# EAGLE schematic Autopilot-8 (EAGLE 7.3.0)
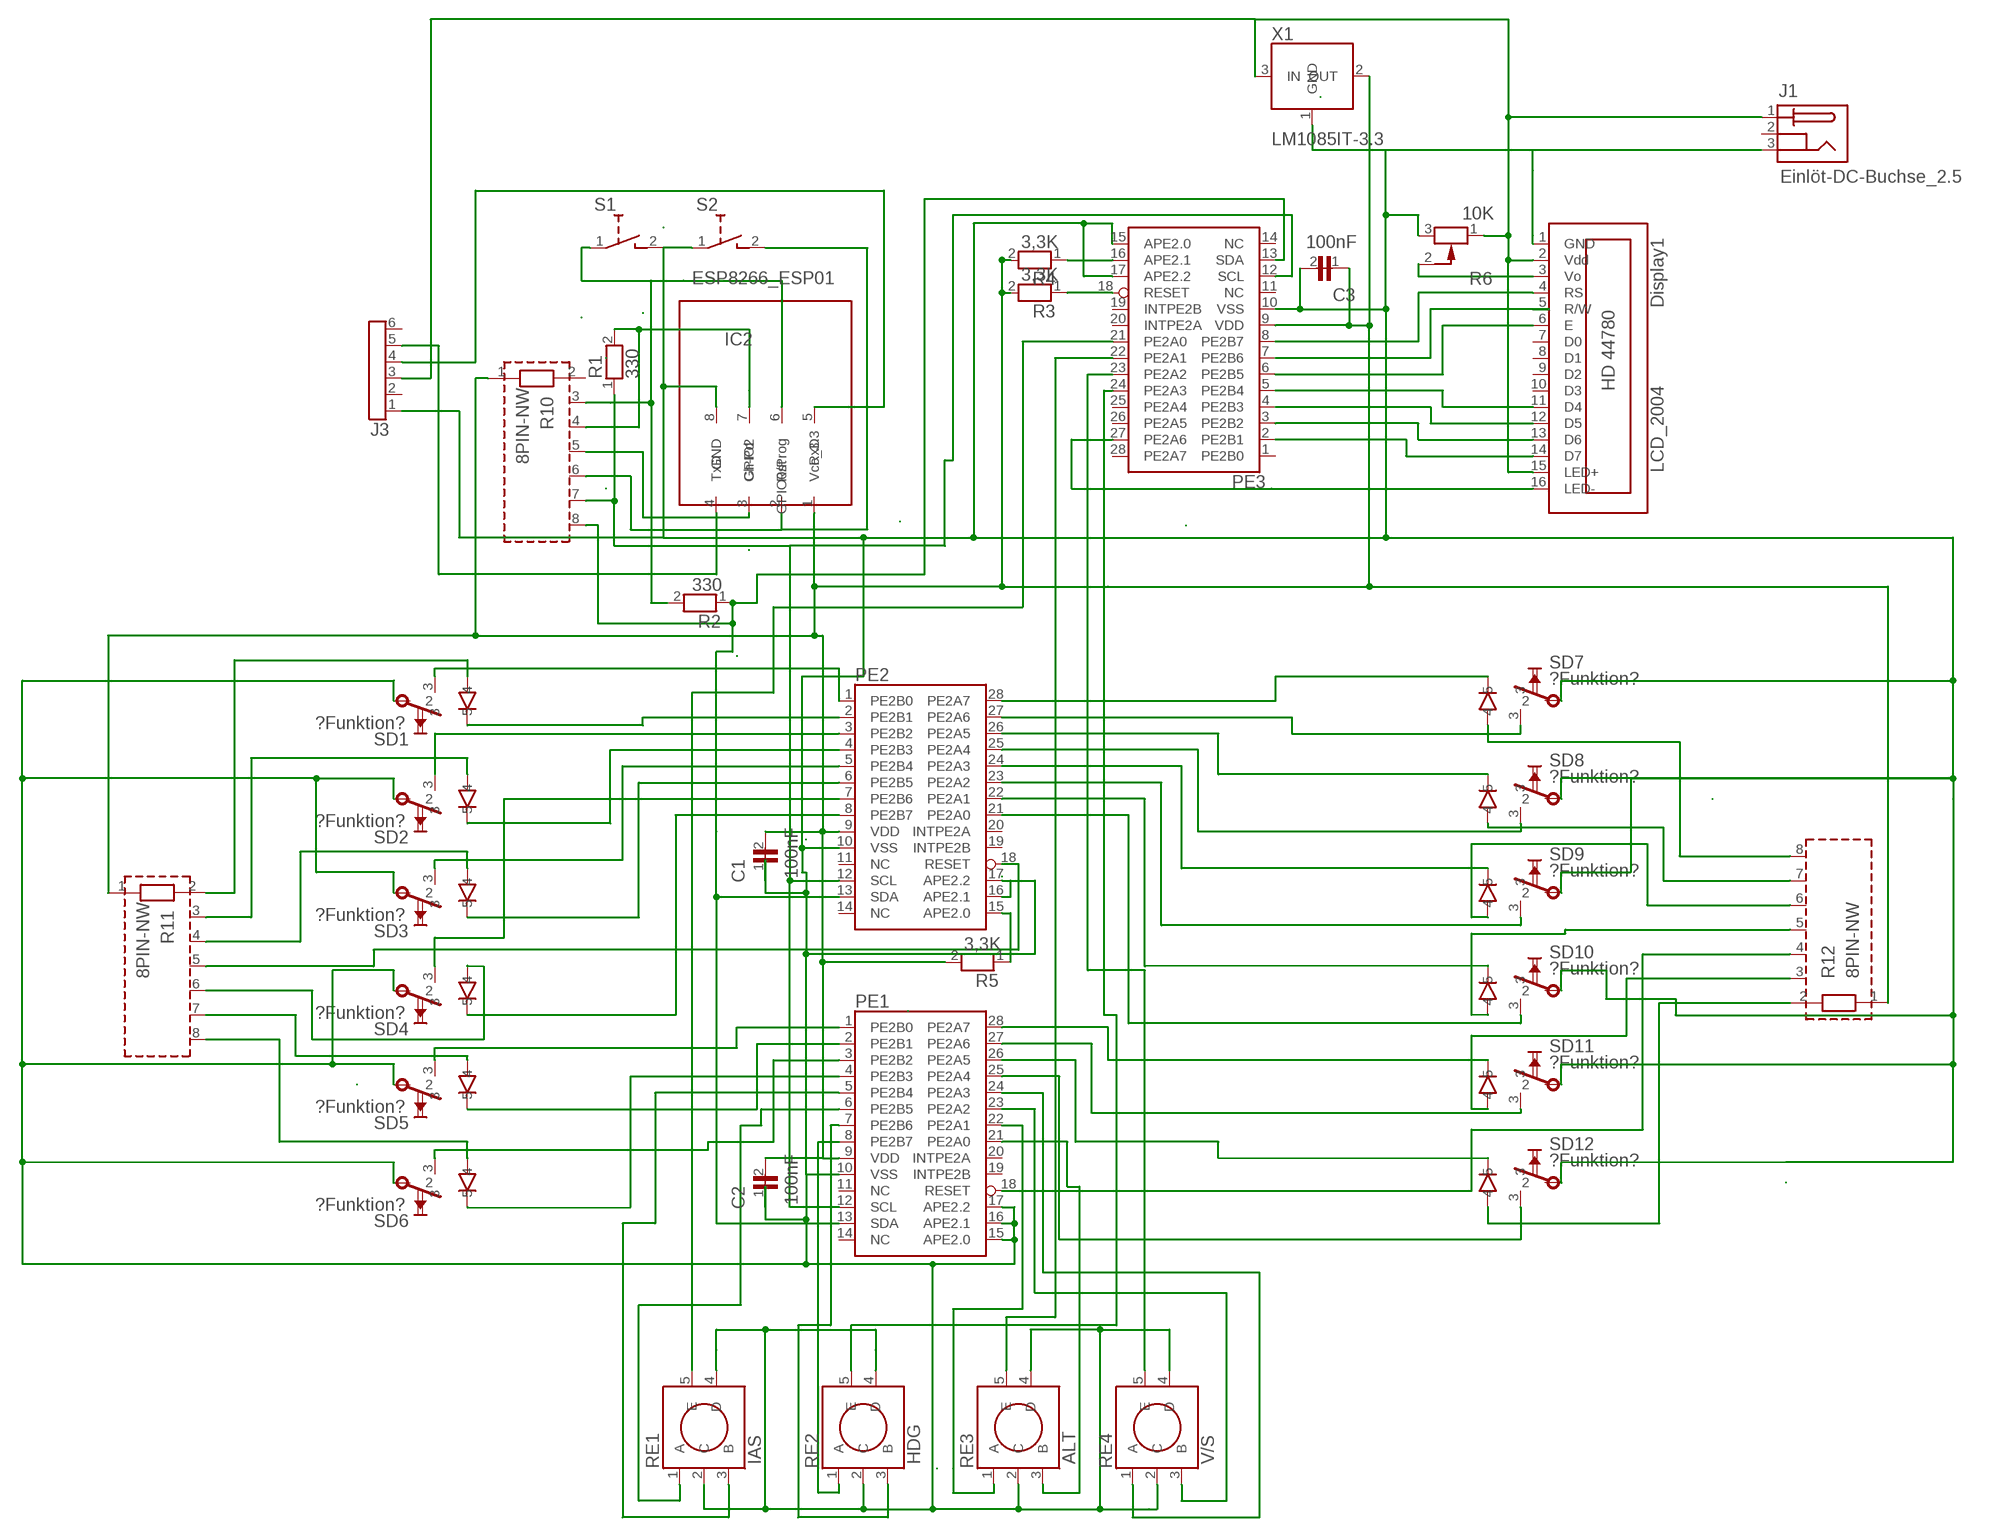
[diagram p0: schematic, sheet 1]

## Parts
C1  100nF  B32521-C1104-K_11  [4X13R10,16_11]
C2  100nF  B32521-C1104-K_12  [4X13R10,16_12]
C3  100nF  B32521-C1104-K_15  [4X13R10,16_15]
Display1  LCD_2004  LCD_2004_13  [LCD2004_13]
IC2  ESP8266_ESP01  ESP8266_ESP01_6  [ESP01_6]
J1  Einlöt-DC-Buchse_2.5  Einlöt-DC-Buchse_2.5_36  [EINLÖT-DC-BUCHSE_2.5MM_36]
J3  PinHeader_1x06_W_2,54  PinHeader_1x06_W_2,54_32  [1X06-90_32]
PE1  PORTEXPANDER MCP23017  PORTEXPANDER_MCP23017_4  [PortExpander_Gehäuse:PDIP-28_4]
PE2  PORTEXPANDER MCP23017  PORTEXPANDER_MCP23017_5  [PortExpander_Gehäuse:PDIP-28_5]
PE3  PORTEXPANDER MCP23017  PORTEXPANDER_MCP23017_14  [PortExpander_Gehäuse:PDIP-28_14]
R1  330  R_carbon_330-Ohm_0207_7  [0207_7]
R2  330  R_carbon_3,3K_0207_8  [0207_8]
R3  3,3K  R_carbon_3,3K_0207_17  [0207_17]
R4  3,3K  R_carbon_3,3K_0207_18  [0207_18]
R5  3,3K  R_carbon_3,3K_0207_19  [0207_19]
R6  10K  PD84_10K_35  [POTI_PD84_35]
R10  8PIN-NW  8PIN-NW_16  [SIL8_16]
R11  8PIN-NW  8PIN-NW_9  [SIL8_9]
R12  8PIN-NW  8PIN-NW_10  [SIL8_10]
RE1  IAS  STEC12E08_3  [STEC12E08_3]
RE2  HDG  STEC12E08_2  [STEC12E08_2]
RE3  ALT  STEC12E08_1  [STEC12E08_1]
RE4  V/S  STEC12E08_0  [STEC12E08_0]
S1  PHAP3362A  PHAP3362A_33  [KURZHUBTASTER_DURCHSTECKMONT._33]
S2  PHAP3362A  PHAP3362A_34  [KURZHUBTASTER_DURCHSTECKMONT._34]
SD1  TASTER_DIGITAST_STD-LED-SJS  TASTER_DIGITAST_STD-LED-SJS_20  [TASTER_DIGITAST_STD(#1)(#1)_20]
SD2  TASTER_DIGITAST_STD-LED-SJS  TASTER_DIGITAST_STD-LED-SJS_21  [TASTER_DIGITAST_STD(#1)(#1)_21]
SD3  TASTER_DIGITAST_STD-LED-SJS  TASTER_DIGITAST_STD-LED-SJS_22  [TASTER_DIGITAST_STD(#1)(#1)_22]
SD4  TASTER_DIGITAST_STD-LED-SJS  TASTER_DIGITAST_STD-LED-SJS_23  [TASTER_DIGITAST_STD(#1)(#1)_23]
SD5  TASTER_DIGITAST_STD-LED-SJS  TASTER_DIGITAST_STD-LED-SJS_24  [TASTER_DIGITAST_STD(#1)(#1)_24]
SD6  TASTER_DIGITAST_STD-LED-SJS  TASTER_DIGITAST_STD-LED-SJS_25  [TASTER_DIGITAST_STD(#1)(#1)_25]
SD7  TASTER_DIGITAST_STD-LED-SJS  TASTER_DIGITAST_STD-LED-SJS_26  [TASTER_DIGITAST_STD(#1)(#1)_26]
SD8  TASTER_DIGITAST_STD-LED-SJS  TASTER_DIGITAST_STD-LED-SJS_27  [TASTER_DIGITAST_STD(#1)(#1)_27]
SD9  TASTER_DIGITAST_STD-LED-SJS  TASTER_DIGITAST_STD-LED-SJS_28  [TASTER_DIGITAST_STD(#1)(#1)_28]
SD10  TASTER_DIGITAST_STD-LED-SJS  TASTER_DIGITAST_STD-LED-SJS_29  [TASTER_DIGITAST_STD(#1)(#1)_29]
SD11  TASTER_DIGITAST_STD-LED-SJS  TASTER_DIGITAST_STD-LED-SJS_30  [TASTER_DIGITAST_STD(#1)(#1)_30]
SD12  TASTER_DIGITAST_STD-LED-SJS  TASTER_DIGITAST_STD-LED-SJS_31  [TASTER_DIGITAST_STD(#1)(#1)_31]
X1  LM1085IT-3.3  LM1085IT-3.3_37  [TO220_37]

## Nets
5V: Display1.2(Vdd) Display1.15(LED+) J1.1(S) J3.3 R6.1 X1.3(IN)
ALT: PE2.23(PE2A2) SD9.3
AP-AUTO: PE2.5(PE2B4) SD3.3
AP-OFF: PE2.1(PE2B0) SD1.3
AP-ON: PE2.3(PE2B2) SD2.3
APE2.0: PE2.15(APE2.0) R5.1
ATHR: PE1.1(PE2B0) SD5.3
B: PE1.23(PE2A2) RE4.3(B)
BC: PE1.25(PE2A4) SD12.3
D4: Display1.11(D4) PE3.5(PE2B4)
D6: Display1.13(D6) PE3.3(PE2B2)
ESP-RST: IC2.2(Rst) R10.6 S2.2
FLCH: PE2.7(PE2B6) SD4.3
GND: C1.1 C2.1 C3.2 Display1.1(GND) IC2.8(GND) J1.3(T) J3.1 PE1.10(VSS) PE1.15(APE2.0) PE1.16(APE2.1) PE1.17(APE2.2) PE2.10(VSS) PE2.16(APE2.1) PE2.17(APE2.2) PE3.10(VSS) PE3.15(APE2.0) PE3.17(APE2.2) R6.3 RE1.2(C) RE1.4(D) RE2.2(C) RE2.4(D) RE3.2(C) RE3.4(D) RE4.2(C) RE4.4(D) S1.2 S2.1 SD1.2 SD2.2 SD3.2 SD4.2 SD5.2 SD6.2 SD7.2 SD8.2 SD9.2 SD10.2 SD11.2 SD12.2 X1.1(GND)
GPIO0/Prog: IC2.6(GPIO0/Prog) R2.2 R10.3 S1.1
GPIO2: IC2.7(GPIO2) R1.2 R10.4
GS: PE2.21(PE2A0) SD10.3
HDG: PE2.27(PE2A6) SD7.3
LED-ALT: PE2.24(PE2A3) SD9.4
LED-AP-AUTP: PE2.6(PE2B5) SD3.4
LED-AP-OFF: PE2.2(PE2B1) SD1.4
LED-AP-ON: PE2.4(PE2B3) SD2.4
LED-ATHR: PE1.2(PE2B1) SD5.4
LED-BC: PE1.26(PE2A5) SD12.4
LED-FLCH: PE2.8(PE2B7) SD4.4
LED-GS: PE2.22(PE2A1) SD10.4
LED-HDG: PE2.28(PE2A7) SD7.4
LED-LOC: PE1.4(PE2B3) SD6.4
LED-VNAV: PE2.26(PE2A5) SD8.4
LED-VS: PE1.28(PE2A7) SD11.4
LOC: PE1.3(PE2B2) SD6.3
PE2A1: PE1.22(PE2A1) RE3.1(A)
PE2B4: PE1.5(PE2B4) RE1.3(B)
PE2B5: Display1.12(D5) PE3.4(PE2B3)
PE2B6: PE1.7(PE2B6) RE2.3(B)
R/W: Display1.5(R/W) PE3.7(PE2B6)
RESET: PE1.18(RESET) R12.4
RS: Display1.4(RS) PE3.8(PE2B7)
SCL: PE1.12(SCL) PE2.12(SCL) PE3.12(SCL) R1.1 R10.7
SDA: PE1.13(SDA) PE2.13(SDA) PE3.13(SDA) R2.1 R10.8
Sig$24: PE1.21(PE2A0) RE3.3(B)
Sig$27: PE1.8(PE2B7) RE2.1(A)
Sig$29: PE1.6(PE2B5) RE1.1(A)
Sig$107: R12.2 SD12.5
Sig$108: R12.7 SD8.5
Sig$118: IC2.3(Ch-Pd) R10.5
Sig$129: R12.3 SD11.5
Sig$131: R12.6 SD9.5
Sig$132: R12.8 SD7.5
Sig$137: R11.2 SD1.5
Sig$138: R11.3 SD2.5
Sig$139: R11.4 SD3.5
Sig$140: PE2.18(RESET) R11.5
Sig$141: R11.6 SD4.5
Sig$142: R11.7 SD5.5
Sig$143: R11.8 SD6.5
Sig$195: Display1.14(D7) PE3.2(PE2B1)
Sig$208: Display1.6(E) PE3.6(PE2B5)
Sig$209: PE3.18(RESET) R3.1
Sig$211: PE3.16(APE2.1) R4.1
Sig$230: R12.5 SD10.5
Sig$260: Display1.16(LED-) PE3.27(PE2A6)
Sig$269: IC2.5(RxD) J3.4
ss0: PE3.21(PE2A0) RE1.5(E)
ss1: PE3.22(PE2A1) RE3.5(E)
ss2: PE3.23(PE2A2) RE4.5(E)
ss3: PE3.24(PE2A3) RE2.5(E)
TxD: IC2.4(TxD) J3.5
VCC3.3: C1.2 C2.2 C3.1 IC2.1(Vcc_3.3) PE1.9(VDD) PE2.9(VDD) PE3.9(VDD) R3.2 R4.2 R5.2 R10.1 R11.1 R12.1 X1.2(OUT)
VNAV: PE2.25(PE2A4) SD8.3
Vo: Display1.3(Vo) R6.2
VS: PE1.27(PE2A6) SD11.3
xx: PE1.24(PE2A3) RE4.1(A)
Unconnected: Display1.7(D0) Display1.8(D1) Display1.9(D2) Display1.10(D3) J1.2(TS) J3.2 J3.6 PE1.11(NC) PE1.14(NC) PE1.19(INTPE2B) PE1.20(INTPE2A) PE2.11(NC) PE2.14(NC) PE2.19(INTPE2B) PE2.20(INTPE2A) PE3.1(PE2B0) PE3.11(NC) PE3.14(NC) PE3.19(INTPE2B) PE3.20(INTPE2A) PE3.25(PE2A4) PE3.26(PE2A5) PE3.28(PE2A7) R10.2

## Library data of the parts
C1 = TARGET3001!_V18.4.0.86:B32521-C1104-K_11
C2 = TARGET3001!_V18.4.0.86:B32521-C1104-K_12
C3 = TARGET3001!_V18.4.0.86:B32521-C1104-K_15
Display1 = TARGET3001!_V18.4.0.86:LCD_2004_13
IC2 = TARGET3001!_V18.4.0.86:ESP8266_ESP01_6
J1 = TARGET3001!_V18.4.0.86:Einlöt-DC-Buchse_2.5_36
J3 = TARGET3001!_V18.4.0.86:PinHeader_1x06_W_2,54_32: Pin Header
PE1 = TARGET3001!_V18.4.0.86:PORTEXPANDER_MCP23017_4
PE2 = TARGET3001!_V18.4.0.86:PORTEXPANDER_MCP23017_5
PE3 = TARGET3001!_V18.4.0.86:PORTEXPANDER_MCP23017_14
R1 = TARGET3001!_V18.4.0.86:R_carbon_330-Ohm_0207_7: Carbon film resistor 330-Ohm, 0,25W, 5%
R2 = TARGET3001!_V18.4.0.86:R_carbon_3,3K_0207_8: Carbon film resistor 3,3K-Ohm, 0,25W, 5%
R3 = TARGET3001!_V18.4.0.86:R_carbon_3,3K_0207_17: Carbon film resistor 3,3K-Ohm, 0,25W, 5%
R4 = TARGET3001!_V18.4.0.86:R_carbon_3,3K_0207_18: Carbon film resistor 3,3K-Ohm, 0,25W, 5%
R5 = TARGET3001!_V18.4.0.86:R_carbon_3,3K_0207_19: Carbon film resistor 3,3K-Ohm, 0,25W, 5%
R6 = TARGET3001!_V18.4.0.86:PD84_10K_35: +-Wire potentiometer, rotation angle 295°
R10 = TARGET3001!_V18.4.0.86:8PIN-NW_16: Network, 7 resistors - a Common
R11 = TARGET3001!_V18.4.0.86:8PIN-NW_9: Network, 7 resistors - a Common
R12 = TARGET3001!_V18.4.0.86:8PIN-NW_10: Network, 7 resistors - a Common
RE1 = TARGET3001!_V18.4.0.86:STEC12E08_3
RE2 = TARGET3001!_V18.4.0.86:STEC12E08_2
RE3 = TARGET3001!_V18.4.0.86:STEC12E08_1
RE4 = TARGET3001!_V18.4.0.86:STEC12E08_0
S1 = TARGET3001!_V18.4.0.86:PHAP3362A_33: Tactile keyboard switch APEM Nr. PHAP3362A ; push-button switch tuck in mounting ; dimension. (length) 5,0 m
S2 = TARGET3001!_V18.4.0.86:PHAP3362A_34: Tactile keyboard switch APEM Nr. PHAP3362A ; push-button switch tuck in mounting ; dimension. (length) 5,0 m
SD1 = TARGET3001!_V18.4.0.86:TASTER_DIGITAST_STD-LED-SJS_20: Switch w/LED
SD2 = TARGET3001!_V18.4.0.86:TASTER_DIGITAST_STD-LED-SJS_21: Switch w/LED
SD3 = TARGET3001!_V18.4.0.86:TASTER_DIGITAST_STD-LED-SJS_22: Switch w/LED
SD4 = TARGET3001!_V18.4.0.86:TASTER_DIGITAST_STD-LED-SJS_23: Switch w/LED
SD5 = TARGET3001!_V18.4.0.86:TASTER_DIGITAST_STD-LED-SJS_24: Switch w/LED
SD6 = TARGET3001!_V18.4.0.86:TASTER_DIGITAST_STD-LED-SJS_25: Switch w/LED
SD7 = TARGET3001!_V18.4.0.86:TASTER_DIGITAST_STD-LED-SJS_26: Switch w/LED
SD8 = TARGET3001!_V18.4.0.86:TASTER_DIGITAST_STD-LED-SJS_27: Switch w/LED
SD9 = TARGET3001!_V18.4.0.86:TASTER_DIGITAST_STD-LED-SJS_28: Switch w/LED
SD10 = TARGET3001!_V18.4.0.86:TASTER_DIGITAST_STD-LED-SJS_29: Switch w/LED
SD11 = TARGET3001!_V18.4.0.86:TASTER_DIGITAST_STD-LED-SJS_30: Switch w/LED
SD12 = TARGET3001!_V18.4.0.86:TASTER_DIGITAST_STD-LED-SJS_31: Switch w/LED
X1 = TARGET3001!_V18.4.0.86:LM1085IT-3.3_37: 3,3V 3A Low Dropout Positive Regulator. 3-Lead TO220 Package.